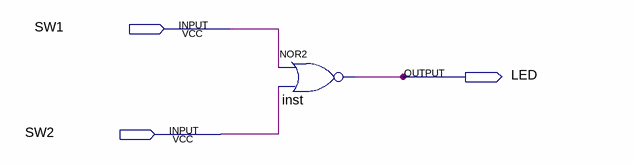
[diagram p0: schematic sheet]
// Quartus schematic ParteA_sch.bdf as structural Verilog: 1 symbols, 3 pins
module ParteA_sch (
  input  SW1,
  input  SW2,
  output LED
);

  nor inst (LED, SW1, SW2);
endmodule
